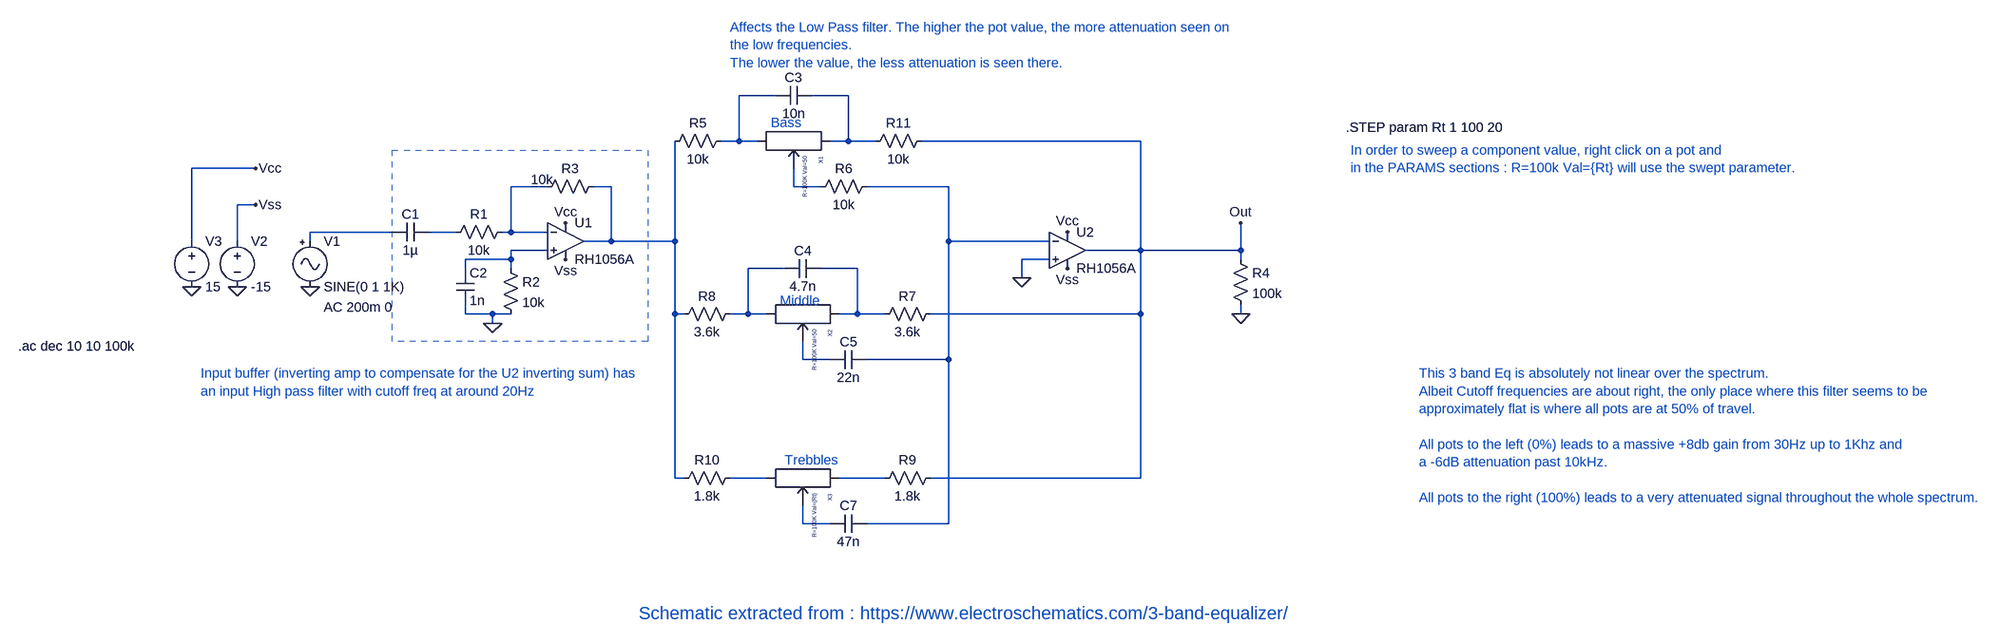
[diagram p0: schematic 3bandeq.asc]
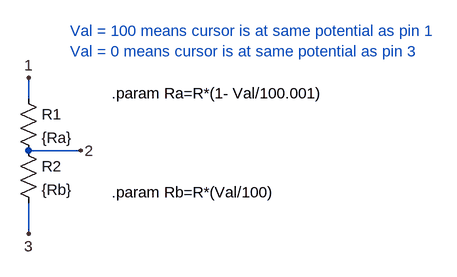
[diagram p1: sub-circuit potentiometer.asc]
3bandeq.asc, the LTspice schematic file:
Version 4
SHEET 1 2840 868
WIRE 592 -128 528 -128
WIRE 720 -128 656 -128
WIRE 528 -48 528 -128
WIRE 528 -48 496 -48
WIRE 560 -48 528 -48
WIRE 720 -48 720 -128
WIRE 720 -48 688 -48
WIRE 768 -48 720 -48
WIRE 1232 -48 848 -48
WIRE -320 0 -432 0
WIRE 192 32 128 32
WIRE 304 32 272 32
WIRE 624 32 624 0
WIRE 672 32 624 32
WIRE 896 32 752 32
WIRE -320 64 -352 64
WIRE -80 112 -224 112
WIRE 32 112 -16 112
WIRE 128 112 128 32
WIRE 128 112 112 112
WIRE 192 112 128 112
WIRE -432 128 -432 0
WIRE -352 128 -352 64
WIRE -224 128 -224 112
WIRE 304 128 304 32
WIRE 304 128 256 128
WIRE 416 128 416 -48
WIRE 416 128 304 128
WIRE 896 128 896 32
WIRE 1072 128 896 128
WIRE 192 144 128 144
WIRE 1232 144 1232 -48
WIRE 1232 144 1136 144
WIRE 1408 144 1408 96
WIRE 1408 144 1232 144
WIRE 128 160 128 144
WIRE 128 160 48 160
WIRE 1072 160 1024 160
WIRE 1408 160 1408 144
WIRE 48 176 48 160
WIRE 128 176 128 160
WIRE 608 176 544 176
WIRE 736 176 672 176
WIRE 1024 192 1024 160
WIRE 48 256 48 240
WIRE 96 256 48 256
WIRE 128 256 96 256
WIRE 416 256 416 128
WIRE 432 256 416 256
WIRE 544 256 544 176
WIRE 544 256 512 256
WIRE 576 256 544 256
WIRE 736 256 736 176
WIRE 736 256 704 256
WIRE 784 256 736 256
WIRE 1232 256 1232 144
WIRE 1232 256 864 256
WIRE 1408 256 1408 240
WIRE 96 272 96 256
WIRE 640 336 640 304
WIRE 688 336 640 336
WIRE 896 336 896 128
WIRE 896 336 752 336
WIRE 416 544 416 256
WIRE 432 544 416 544
WIRE 576 544 512 544
WIRE 784 544 704 544
WIRE 1232 544 1232 256
WIRE 1232 544 864 544
WIRE 640 624 640 592
WIRE 688 624 640 624
WIRE 896 624 896 336
WIRE 896 624 752 624
FLAG -352 208 0
FLAG -432 208 0
FLAG -320 64 Vss
FLAG -320 0 Vcc
FLAG -224 208 0
FLAG 224 96 Vcc
FLAG 1104 112 Vcc
FLAG 224 160 Vss
FLAG 1104 176 Vss
FLAG 96 272 0
FLAG 1408 256 0
FLAG 1024 192 0
FLAG 1408 96 Out
SYMBOL OpAmps\\RH1056A 224 64 R0
SYMATTR InstName U1
SYMBOL Misc\\signal -224 112 R0
WINDOW 123 24 132 Left 2
WINDOW 39 0 0 Left 0
SYMATTR InstName V1
SYMATTR Value2 AC 200m 0
SYMBOL voltage -352 112 R0
WINDOW 123 0 0 Left 0
WINDOW 39 0 0 Left 0
SYMATTR InstName V2
SYMATTR Value -15
SYMBOL voltage -432 112 R0
WINDOW 123 0 0 Left 0
WINDOW 39 0 0 Left 0
SYMATTR InstName V3
SYMATTR Value 15
SYMBOL OpAmps\\RH1056A 1104 80 R0
SYMATTR InstName U2
SYMBOL cap -16 96 R90
WINDOW 0 0 32 VBottom 2
WINDOW 3 32 32 VTop 2
SYMATTR InstName C1
SYMATTR Value 1µ
SYMBOL res 128 96 R90
WINDOW 0 0 56 VBottom 2
WINDOW 3 32 56 VTop 2
SYMATTR InstName R1
SYMATTR Value 10k
SYMBOL res 112 160 R0
SYMATTR InstName R2
SYMATTR Value 10k
SYMBOL cap 32 176 R0
SYMATTR InstName C2
SYMATTR Value 1n
SYMBOL res 288 16 R90
WINDOW 0 0 56 VBottom 2
WINDOW 3 -12 105 VTop 2
SYMATTR InstName R3
SYMATTR Value 10k
SYMBOL Potentiometer 624 -48 R90
WINDOW 39 28 -21 Left 0
SYMATTR InstName X1
SYMATTR SpiceLine R=100K Val=50
SYMBOL cap 656 -144 R90
WINDOW 0 0 32 VBottom 2
WINDOW 3 32 32 VTop 2
SYMATTR InstName C3
SYMATTR Value 10n
SYMBOL res 512 -64 R90
WINDOW 0 0 56 VBottom 2
WINDOW 3 32 56 VTop 2
SYMATTR InstName R5
SYMATTR Value 10k
SYMBOL res 768 16 R90
WINDOW 0 0 56 VBottom 2
WINDOW 3 32 56 VTop 2
SYMATTR InstName R6
SYMATTR Value 10k
SYMBOL Potentiometer 640 256 R90
WINDOW 39 28 -21 Left 0
SYMATTR InstName X2
SYMATTR SpiceLine R=100K Val=50
SYMBOL cap 672 160 R90
WINDOW 0 0 32 VBottom 2
WINDOW 3 32 32 VTop 2
SYMATTR InstName C4
SYMATTR Value 4.7n
SYMBOL res 880 240 R90
WINDOW 0 0 56 VBottom 2
WINDOW 3 32 56 VTop 2
SYMATTR InstName R7
SYMATTR Value 3.6k
SYMBOL res 528 240 R90
WINDOW 0 0 56 VBottom 2
WINDOW 3 32 56 VTop 2
SYMATTR InstName R8
SYMATTR Value 3.6k
SYMBOL cap 752 320 R90
WINDOW 0 0 32 VBottom 2
WINDOW 3 32 32 VTop 2
SYMATTR InstName C5
SYMATTR Value 22n
SYMBOL Potentiometer 640 544 R90
WINDOW 39 28 -21 Left 0
SYMATTR InstName X3
SYMATTR SpiceLine R=100K Val={Rt}
SYMBOL res 880 528 R90
WINDOW 0 0 56 VBottom 2
WINDOW 3 32 56 VTop 2
SYMATTR InstName R9
SYMATTR Value 1.8k
SYMBOL res 528 528 R90
WINDOW 0 0 56 VBottom 2
WINDOW 3 32 56 VTop 2
SYMATTR InstName R10
SYMATTR Value 1.8k
SYMBOL cap 752 608 R90
WINDOW 0 0 32 VBottom 2
WINDOW 3 32 32 VTop 2
SYMATTR InstName C7
SYMATTR Value 47n
SYMBOL res 1392 144 R0
SYMATTR InstName R4
SYMATTR Value 100k
SYMBOL res 864 -64 R90
WINDOW 0 0 56 VBottom 2
WINDOW 3 32 56 VTop 2
SYMATTR InstName R11
SYMATTR Value 10k
TEXT -736 312 Left 2 !.ac dec 10 10 100k
TEXT 1616 -72 Left 2 !.STEP param Rt 1 100 20
TEXT 512 -248 Left 2 ;Affects the Low Pass filter. The higher the pot value, the more attenuation seen on \nthe low frequencies.\nThe lower the value, the less attenuation is seen there.
TEXT 600 232 Left 2 ;Middle
TEXT 584 -80 Left 2 ;Bass
TEXT 608 512 Left 2 ;Trebbles
TEXT 1744 360 Left 2 ;This 3 band Eq is absolutely not linear over the spectrum. \nAlbeit Cutoff frequencies are about right, the only place where this filter seems to be \napproximately flat is where all pots are at 50% of travel.\n \nAll pots to the left (0%) leads to a massive +8db gain from 30Hz up to 1Khz and \na -6dB attenuation past 10kHz.\n \nAll pots to the right (100%) leads to a very attenuated signal throughout the whole spectrum.
TEXT 1624 -32 Left 2 ;In order to sweep a component value, right click on a pot and \nin the PARAMS sections : R=100k Val={Rt} will use the swept parameter.
TEXT 352 848 Left 3 ;Schematic extracted from : https://www.electroschematics.com/3-band-equalizer/
TEXT -416 360 Left 2 ;Input buffer (inverting amp to compensate for the U2 inverting sum) has \nan input High pass filter with cutoff freq at around 20Hz
RECTANGLE Normal 368 304 -80 -32 2

potentiometer.asc, the sub-circuit schematic file:
Version 4
SHEET 1 908 680
WIRE 192 96 192 64
WIRE 272 176 192 176
WIRE 192 304 192 256
FLAG 192 64 1
FLAG 272 176 2
FLAG 192 304 3
SYMBOL res 176 80 R0
SYMATTR InstName R1
SYMATTR Value {Ra}
SYMBOL res 176 160 R0
SYMATTR InstName R2
SYMATTR Value {Rb}
TEXT 320 88 Left 2 !.param Ra=R*(1- Val/100.001)
TEXT 320 240 Left 2 !.param Rb=R*(Val/100)
TEXT 256 -8 Left 2 ;Val = 100 means cursor is at same potential as pin 1\nVal = 0 means cursor is at same potential as pin 3

The netlist it stands for:
* 3bandeq.asc
XU1 N009 N003 Vcc Vss N004 RH1056A  ; pins In+ In- V+ V- OUT
V1 N007 0 SINE(0 1 1K) AC 200m 0
V2 Vss 0 -15
V3 Vcc 0 15
XU2 0 N006 Vcc Vss Out RH1056A  ; pins In+ In- V+ V- OUT
C1 N008 N007 1µ
R1 N003 N008 10k
R2 N009 0 10k
C2 N009 0 1n
R3 N004 N003 10k
XX1 N002 N005 N001 potentiometer params: R=100K Val=50
C3 N002 N001 10n
R5 N001 N004 10k
R6 N006 N005 10k
XX2 N011 N012 N010 potentiometer params: R=100K Val=50
C4 N011 N010 4.7n
R7 Out N011 3.6k
R8 N010 N004 3.6k
C5 N006 N012 22n
XX3 N014 N015 N013 potentiometer params: R=100K Val={Rt}
R9 Out N014 1.8k
R10 N013 N004 1.8k
C7 N006 N015 47n
R4 Out 0 100k
R11 Out N002 10k

* block symbol definitions
.subckt potentiometer 1 2 3
R1 1 2 {Ra}
R2 2 3 {Rb}
.param Ra=R*(1- Val/100.001)
.param Rb=R*(Val/100)
* Val = 100 means cursor is at same potential as pin 1
* Val = 0 means cursor is at same potential as pin 3
.ends potentiometer

.ac dec 10 10 100k
.STEP param Rt 1 100 20
* Affects the Low Pass filter. The higher the pot value, the more attenuation seen on
* the low frequencies.
* The lower the value, the less attenuation is seen there.
* Middle
* Bass
* Trebbles
* This 3 band Eq is absolutely not linear over the spectrum.
* Albeit Cutoff frequencies are about right, the only place where this filter seems to be
* approximately flat is where all pots are at 50% of travel.
* All pots to the left (0%) leads to a massive +8db gain from 30Hz up to 1Khz and
* a -6dB attenuation past 10kHz.
* All pots to the right (100%) leads to a very attenuated signal throughout the whole spectrum.
* In order to sweep a component value, right click on a pot and
* in the PARAMS sections : R=100k Val={Rt} will use the swept parameter.
* Schematic extracted from : https://www.electroschematics.com/3-band-equalizer/
* Input buffer (inverting amp to compensate for the U2 inverting sum) has
* an input High pass filter with cutoff freq at around 20Hz
.backanno
.end